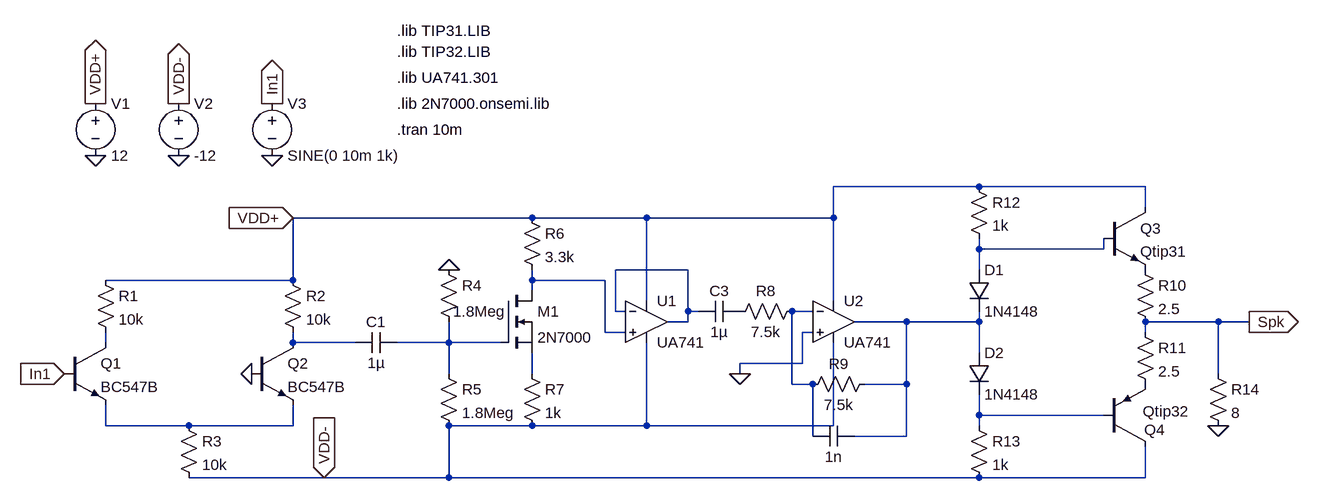
[diagram p0: schematic EW2_project1_hardware_compliant_2.asc]
EW2_project1_hardware_compliant_2.asc, the LTspice schematic file:
Version 4
SHEET 1 1848 860
WIRE 1328 240 1104 240
WIRE 1584 240 1328 240
WIRE 1584 272 1584 240
WIRE 640 288 272 288
WIRE 816 288 640 288
WIRE 1104 288 1104 240
WIRE 1104 288 816 288
WIRE 1328 336 1328 320
WIRE 1520 336 1520 320
WIRE 1520 336 1328 336
WIRE 880 368 768 368
WIRE 1328 368 1328 336
WIRE 272 384 272 288
WIRE 272 384 -16 384
WIRE 640 384 640 368
WIRE 752 384 640 384
WIRE 640 400 640 384
WIRE 816 416 816 288
WIRE 1104 416 1104 288
WIRE 768 432 768 368
WIRE 784 432 768 432
WIRE 880 432 880 368
WIRE 896 432 880 432
WIRE 1072 432 1040 432
WIRE 880 448 880 432
WIRE 880 448 848 448
WIRE 1216 448 1136 448
WIRE 1328 448 1328 432
WIRE 1328 448 1216 448
WIRE 1696 448 1584 448
WIRE 1744 448 1696 448
WIRE 752 464 752 384
WIRE 784 464 752 464
WIRE 1072 464 1056 464
WIRE 1584 464 1584 448
WIRE -16 480 -16 464
WIRE 272 480 272 464
WIRE 368 480 272 480
WIRE 512 480 512 448
WIRE 512 480 432 480
WIRE 592 480 512 480
WIRE 1328 496 1328 448
WIRE 1056 512 1056 464
WIRE 1056 512 960 512
WIRE 512 528 512 480
WIRE 640 528 640 496
WIRE 960 528 960 512
WIRE 1696 528 1696 448
WIRE 1040 544 1040 432
WIRE 1072 544 1040 544
WIRE 1216 544 1216 448
WIRE 1216 544 1152 544
WIRE 1328 592 1328 560
WIRE 1520 592 1328 592
WIRE -16 608 -16 576
WIRE 112 608 -16 608
WIRE 272 608 272 576
WIRE 272 608 112 608
WIRE 640 608 512 608
WIRE 816 608 816 480
WIRE 816 608 640 608
WIRE 1104 608 1104 480
WIRE 1104 608 816 608
WIRE 1328 608 1328 592
WIRE 1072 624 1072 544
WIRE 1216 624 1216 544
WIRE 1216 624 1136 624
WIRE 320 688 112 688
WIRE 512 688 512 608
WIRE 512 688 320 688
WIRE 1328 688 512 688
WIRE 1584 688 1584 640
WIRE 1584 688 1328 688
FLAG 96 112 VDD-
IOPIN 96 112 Out
FLAG -32 112 VDD+
IOPIN -32 112 Out
FLAG 96 192 0
FLAG -32 192 0
FLAG 512 368 0
FLAG 1696 608 0
FLAG 1744 448 Spk
IOPIN 1744 448 Out
FLAG 272 288 VDD+
IOPIN 272 288 In
FLAG 320 688 VDD-
IOPIN 320 688 In
FLAG -80 528 In1
IOPIN -80 528 In
FLAG 960 528 0
FLAG 240 112 In1
IOPIN 240 112 Out
FLAG 240 192 0
FLAG 208 528 0
SYMBOL voltage -32 96 R0
WINDOW 123 0 0 Left 0
WINDOW 39 0 0 Left 0
SYMATTR InstName V1
SYMATTR Value 12
SYMBOL voltage 96 96 R0
WINDOW 123 0 0 Left 0
WINDOW 39 0 0 Left 0
SYMATTR InstName V2
SYMATTR Value -12
SYMBOL voltage 240 96 R0
WINDOW 123 794 -36 Left 2
WINDOW 39 0 0 Left 0
SYMATTR InstName V3
SYMATTR Value SINE(0 10m 1k)
SYMBOL npn -80 480 R0
SYMATTR InstName Q1
SYMATTR Value BC547B
SYMBOL npn 208 480 R0
SYMATTR InstName Q2
SYMATTR Value BC547B
SYMBOL res -32 368 R0
SYMATTR InstName R1
SYMATTR Value 10k
SYMBOL res 256 368 R0
SYMATTR InstName R2
SYMATTR Value 10k
SYMBOL res 96 592 R0
SYMATTR InstName R3
SYMATTR Value 10k
SYMBOL nmos 592 400 R0
SYMATTR InstName M1
SYMATTR Value 2N7000
SYMATTR Prefix X
SYMBOL cap 432 464 R90
WINDOW 0 0 32 VBottom 2
WINDOW 3 32 32 VTop 2
SYMATTR InstName C1
SYMATTR Value 1µ
SYMBOL res 496 352 R0
WINDOW 3 22 80 Left 2
SYMATTR Value 1.8Meg
SYMATTR InstName R4
SYMBOL res 496 512 R0
SYMATTR InstName R5
SYMATTR Value 1.8Meg
SYMBOL res 624 272 R0
SYMATTR InstName R6
SYMATTR Value 3.3k
SYMBOL res 624 512 R0
SYMATTR InstName R7
SYMATTR Value 1k
SYMBOL OpAmps\\opamp2 816 384 R0
SYMATTR InstName U1
SYMATTR Value UA741
SYMBOL OpAmps\\opamp2 1104 384 R0
SYMATTR InstName U2
SYMATTR Value UA741
SYMBOL res 1168 528 R90
WINDOW 0 0 56 VBottom 2
WINDOW 3 32 56 VTop 2
SYMATTR InstName R9
SYMATTR Value 7.5k
SYMBOL cap 1136 608 R90
WINDOW 0 0 32 Invisible 2
WINDOW 3 32 32 VTop 2
SYMATTR InstName C2
SYMATTR Value 1n
SYMBOL npn 1520 272 R0
SYMATTR InstName Q3
SYMATTR Value Qtip31
SYMATTR Prefix Qtip31
SYMBOL pnp 1520 640 M180
WINDOW 0 62 26 Left 2
WINDOW 3 60 54 Left 2
SYMATTR InstName Q4
SYMATTR Value Qtip32
SYMATTR Prefix Qtip32
SYMBOL res 1568 352 R0
SYMATTR InstName R10
SYMATTR Value 2.5
SYMBOL res 1568 448 R0
SYMATTR InstName R11
SYMATTR Value 2.5
SYMBOL res 1312 224 R0
SYMATTR InstName R12
SYMATTR Value 1k
SYMBOL res 1312 592 R0
SYMATTR InstName R13
SYMATTR Value 1k
SYMBOL diode 1312 368 R0
SYMATTR InstName D1
SYMATTR Value 1N4148
SYMBOL diode 1312 496 R0
SYMATTR InstName D2
SYMATTR Value 1N4148
SYMBOL res 1680 512 R0
SYMATTR InstName R14
SYMATTR Value 8
SYMBOL res 1056 416 R90
WINDOW 0 0 56 VBottom 2
WINDOW 3 32 56 VTop 2
SYMATTR InstName R8
SYMATTR Value 7.5k
SYMBOL cap 960 416 R90
WINDOW 0 0 32 VBottom 2
WINDOW 3 32 32 VTop 2
SYMATTR InstName C3
SYMATTR Value 1µ
TEXT 432 0 Left 2 !.lib TIP31.LIB
TEXT 432 32 Left 2 !.lib TIP32.LIB
TEXT 432 72 Left 2 !.lib UA741.301
TEXT 432 112 Left 2 !.lib 2N7000.onsemi.lib
TEXT 432 152 Left 2 !.tran 10m

The netlist it stands for:
* EW2_project1_hardware_compliant_2.asc
V1 VDD+ 0 12
V2 VDD- 0 -12
V3 In1 0 SINE(0 10m 1k)
Q1 N006 In1 N011 0 BC547B
Q2 N007 0 N011 0 BC547B
R1 VDD+ N006 10k
R2 VDD+ N007 10k
R3 N011 VDD- 10k
XM1 N003 N008 N009 2N7000  ; pins D G S
C1 N008 N007 1µ
R4 0 N008 1.8Meg
R5 N008 VDD- 1.8Meg
R6 VDD+ N003 3.3k
R7 N009 VDD- 1k
XU1 N003 N002 VDD+ VDD- N002 UA741  ; pins In+ In- V+ V- OUT
XU2 0 N004 VDD+ VDD- N005 UA741  ; pins In+ In- V+ V- OUT
R9 N005 N004 7.5k
C2 N005 N004 1n
Q3 VDD+ N001 P001 0 Qtip31
Q4 VDD- N010 P002 0 Qtip32
R10 P001 Spk 2.5
R11 Spk P002 2.5
R12 VDD+ N001 1k
R13 N010 VDD- 1k
D1 N001 N005 1N4148
D2 N005 N010 1N4148
R14 Spk 0 8
R8 N004 P003 7.5k
C3 P003 N002 1µ
.model D D
.lib standard.dio
.model NPN NPN
.model PNP PNP
.lib standard.bjt
.lib TIP31.LIB
.lib TIP32.LIB
.lib UA741.301
.lib 2N7000.onsemi.lib
.tran 10m
.backanno
.end